# Altium schematic sheet Output&1Wire.SchDoc
size A4
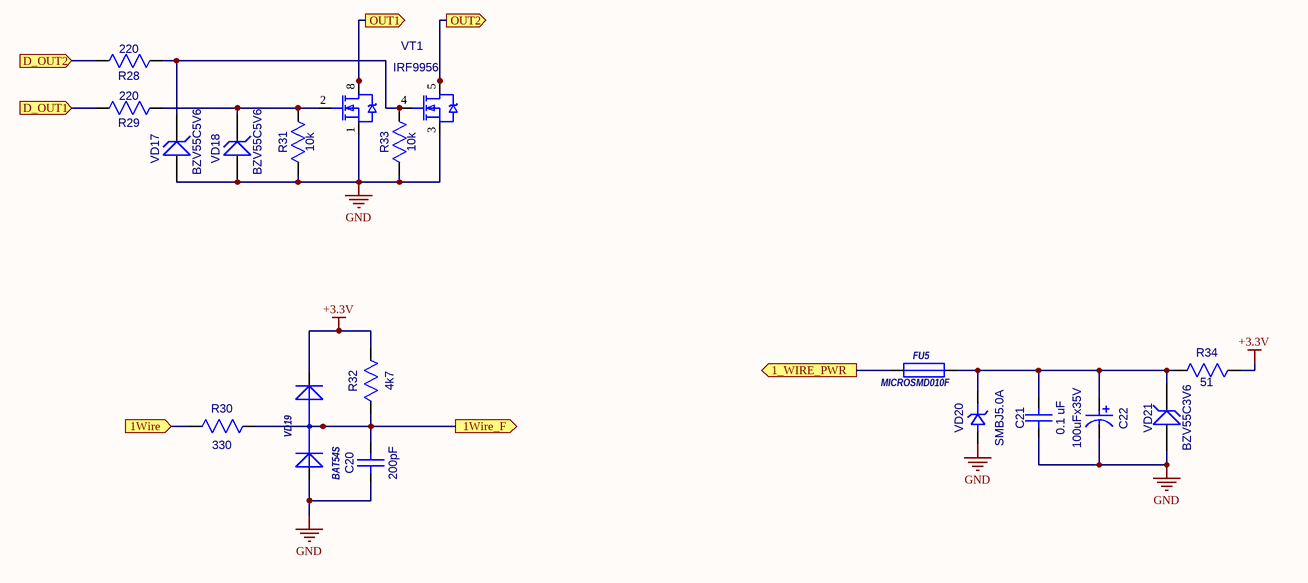
[diagram p0: Output&1Wire.SchDoc]

## Parts
C20  200pF  [CC0603-3M]
C21  0.1 uF  [CC0603-3M]
C22  100uFx35V  [CC20X2.54]
FU5  MICROSMD010F  [RC1210]
R28  220  [RC0603-3M]
R29  220  [RC0603-3M]
R30  330  [RC0603-3M]
R31  10k  [RC0603-3M]
R32  4k7  [RC0603-3M]
R33  10k  [RC0603-3M]
R34  51  [RC1206-2M]
VD17  BZV55C5V6  [SOD-80]
VD18  BZV55C5V6  [SOD-80]
VD19  BAT54S  [SOT-23(GSD)]
VD20  SMBJ5.0A  [SMB]
VD21  BZV55C3V6  [SOD-80]
VT1  IRF9956  [SO-8]

## Ports
1_WIRE_PWR (out), 1Wire (in), 1Wire_F (out), D_OUT1 (in), D_OUT2 (in), OUT1 (out), OUT2 (out)

## Nets
+3.3V: R32.2(B) R34.2(B) VD19.2(K)
GND: C20.1(A) C21.1(A) C22.2(minus) R31.2(B) R33.2(B) VD17.1(A) VD18.1(A) VD19.1(A) VD20.1(A) VD21.1(A) VT1.1(S) VT1.3(S)
1_WIRE_PWR: FU5.2 ; port 1_WIRE_PWR
1Wire: R30.1(A) ; port 1Wire
1Wire_F: C20.2(B) R30.2(B) R32.1(A) VD19.3(AK) ; port 1Wire_F
D_OUT1: R29.1(A) ; port D_OUT1
D_OUT2: R28.1(A) ; port D_OUT2
OUT1: VT1.7(D) VT1.8(D) ; port OUT1
OUT2: VT1.5(D) VT1.6(D) ; port OUT2
NetC21_2: C21.2(B) C22.1(plus) FU5.1 R34.1(A) VD20.2(K) VD21.2
NetR28_2: R28.2(B) R33.1(A) VD17.2 VT1.4(G)
NetR29_2: R29.2(B) R31.1(A) VD18.2 VT1.2(G)

## Library data of the parts
C20 C21 = CC0603
  C20: Value: 200pF
  C21: Value: 0.1 uF
C22 = CAP0.25: Value: 100uFx35V
FU5 = MICROSMD: Value: MICROSMD010F
R28-R33 = RC0603
  R28 R29: Value: 220
  R30: Value: 330
  R31 R33: Value: 10k
  R32: Value: 4k7
R34 = RC1206: Value: 51
VD17 VD18 = BZV55C3V0: OriginalName: BZX84C10LT1; ComponentField6: Pin 2 is not connected and not drawn.; ComponentField7: Published 29-Sep-2000; Value: BZV55C5V6
VD19 = BAT54S: 1.0 Ampere General Purpose Rectifier; ComponentField6: Published 8-Jun-2000, Modified 11-July-2000: SIM Model Added.; Value: *
VD20 = SMBJ: Value: SMBJ5.0A
VD21 = BZV55C12: OriginalName: BZX84C10LT1; ComponentField6: Pin 2 is not connected and not drawn.; ComponentField7: Published 29-Sep-2000; Value: BZV55C3V6
VT1 = IRF9956: OriginalName: IRLML2402; ComponentField7: Published 8-Jun-2000